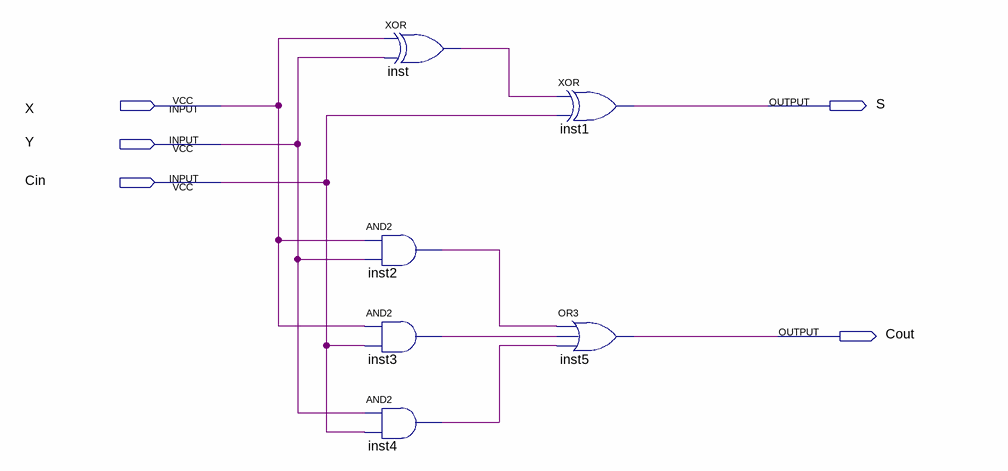
[diagram p0: schematic sheet]
// Quartus schematic FA_1bit.bdf as structural Verilog: 6 symbols, 5 pins
module FA_1bit (
  input  X,
  input  Y,
  input  Cin,
  output S,
  output Cout
);

  wire inst2_out, inst3_out, inst4_out, inst_out;

  xor inst (inst_out, X, Y);
  and inst2 (inst2_out, X, Y);
  and inst3 (inst3_out, X, Cin);
  and inst4 (inst4_out, Y, Cin);
  xor inst1 (S, inst_out, Cin);
  or inst5 (Cout, inst2_out, inst3_out, inst4_out);
endmodule
